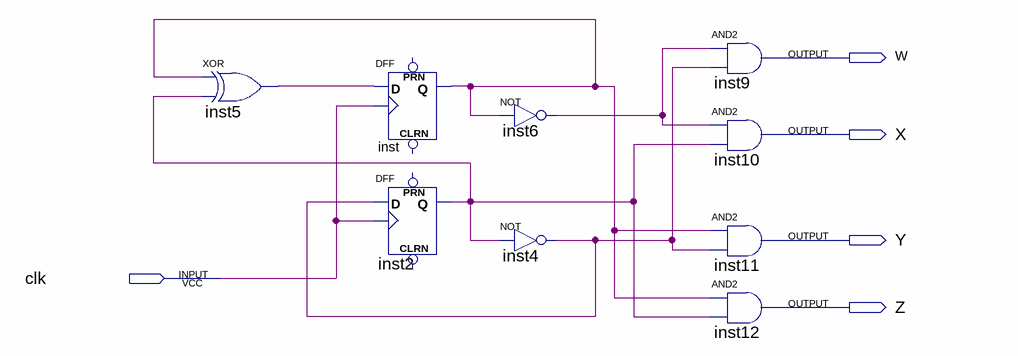
[diagram p0: schematic sheet]
// Quartus schematic old_4count.bdf as structural Verilog: 9 symbols, 5 pins
module old_4count (
  input  clk,
  output W,
  output X,
  output Y,
  output Z
);

  wire inst2_q, inst4_out, inst5_out, inst6_out, inst_q;

  xor inst5 (inst5_out, inst_q, inst2_q);
  DFF inst (.CLK(clk), .D(inst5_out), .Q(inst_q));  // open: CLRN, PRN
  DFF inst2 (.CLK(clk), .D(inst4_out), .Q(inst2_q));  // open: CLRN, PRN
  not inst6 (inst6_out, inst_q);
  not inst4 (inst4_out, inst2_q);
  and inst9 (W, inst6_out, inst4_out);
  and inst10 (X, inst6_out, inst2_q);
  and inst11 (Y, inst_q, inst4_out);
  and inst12 (Z, inst_q, inst2_q);
endmodule
